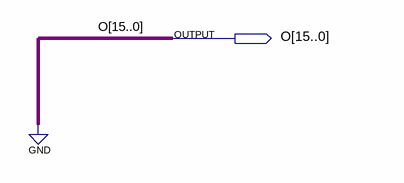
[diagram p0: schematic sheet]
// Quartus schematic z_0.bdf as structural Verilog: 0 symbols, 1 pins
module z_0 (
  output [15:0] O
);


  assign O = {16{1'b0}};
endmodule
